# EAGLE board robot_PI4_F28379D_v1 (EAGLE 7.7.0), part 1 of 2
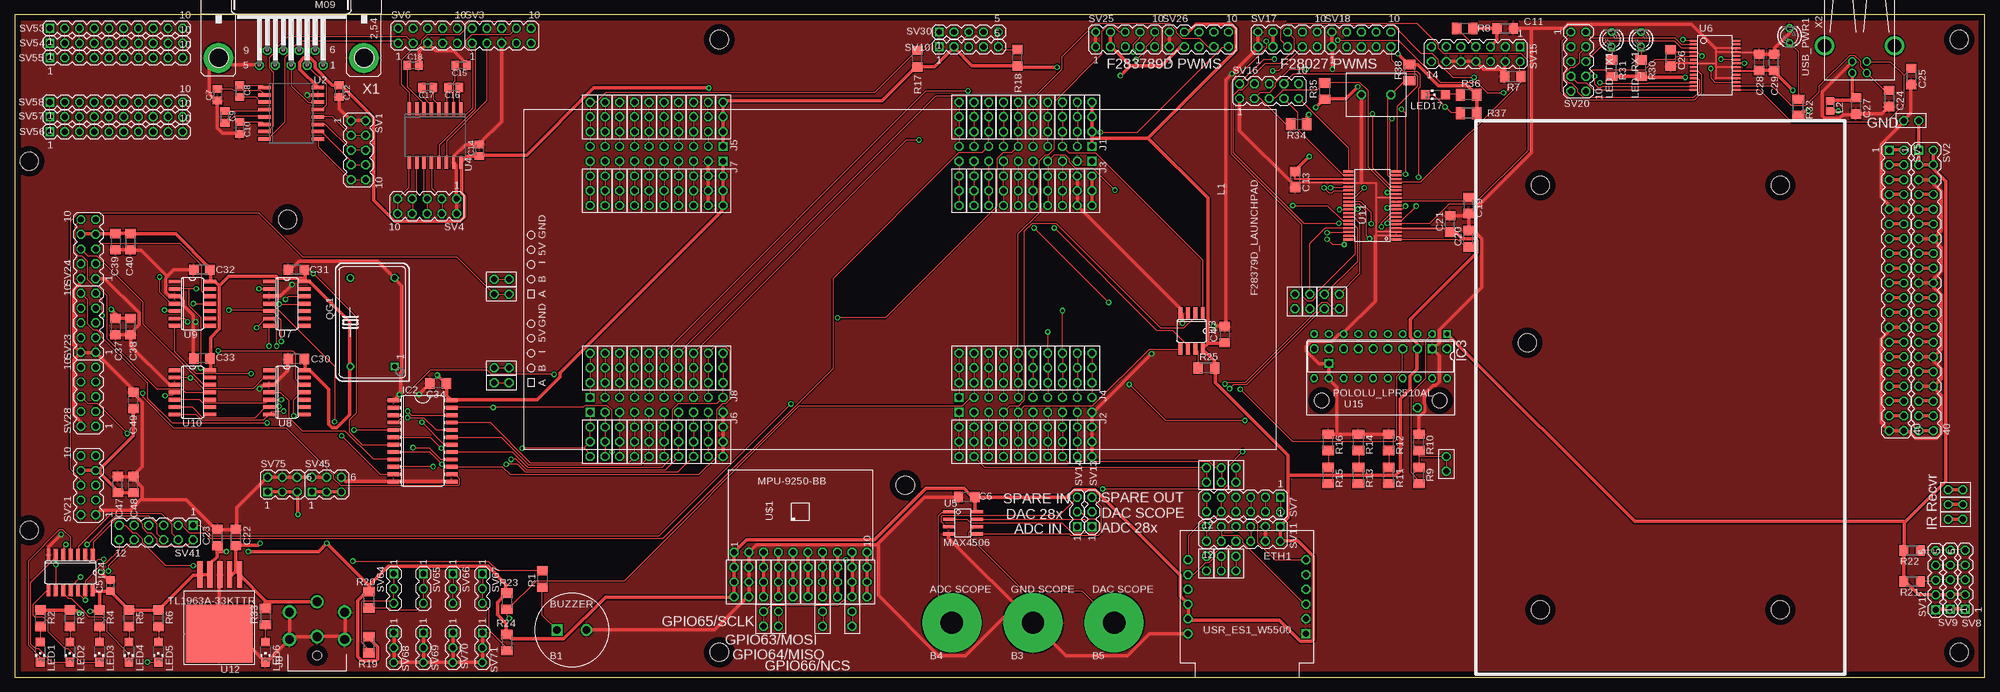
[diagram p6: board, top side]
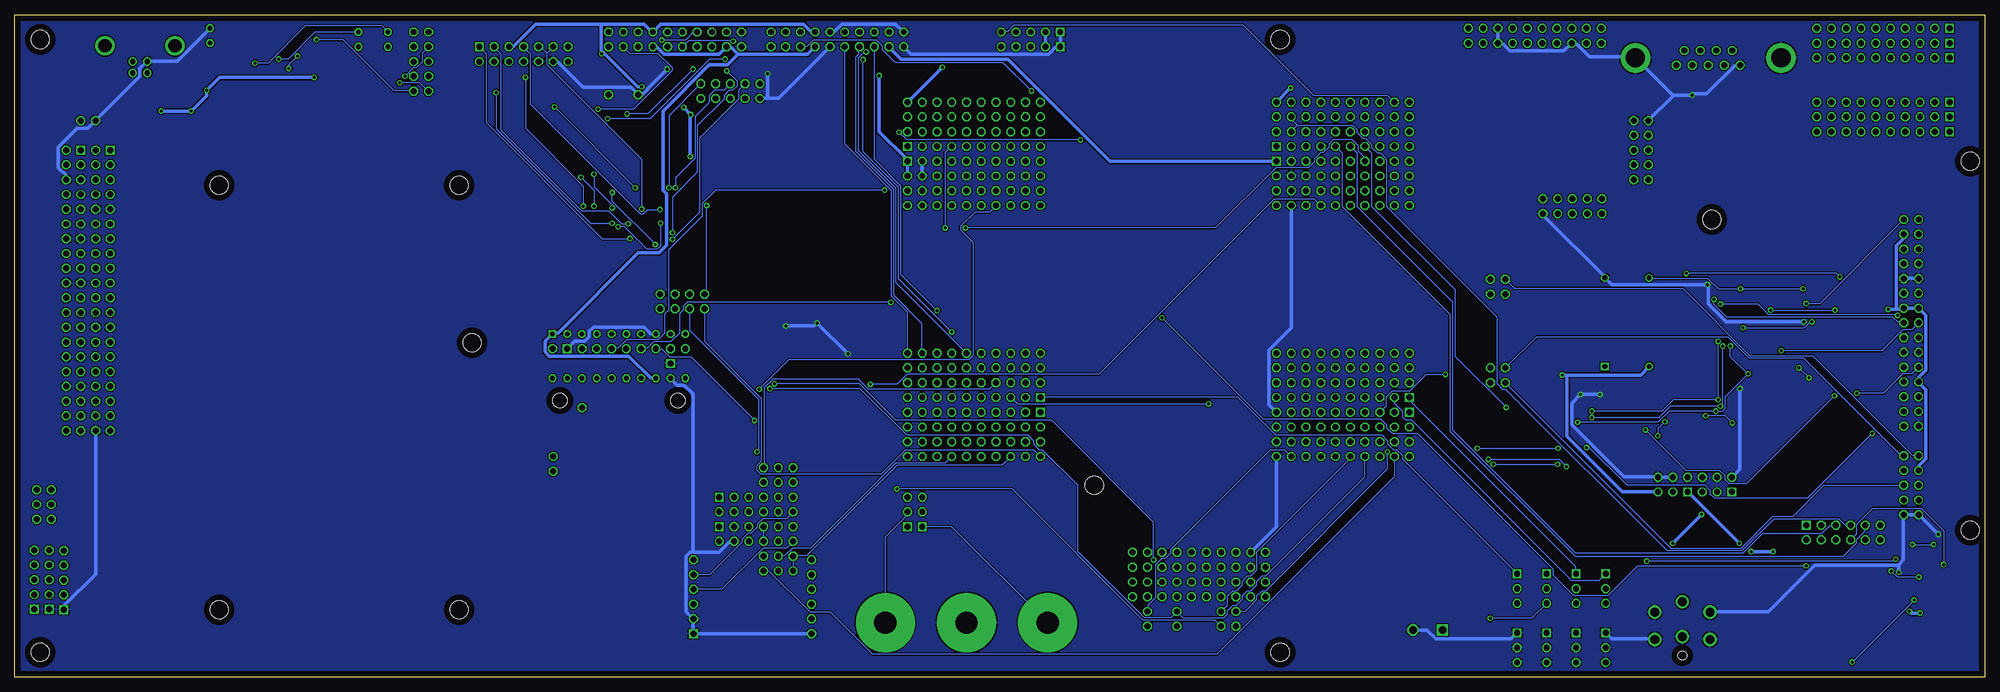
[diagram p7: board, bottom side, seen from below]

Size 339.07 x 113.97 mm. Coordinates in mm from the lower left corner, seen from the top.
Outline: 0,0 339.07,0 339.07,113.97 0,113.97 0,0
Copper layers (1*16): Top 0.035mm / dielectric 1.5mm / Bottom 0.035mm
Design rules "default *": minimum track width 8mil, minimum drill 20mil, track to track 8mil, track to pad 8mil, pad to pad 8mil, via to via 8mil, smd to smd 8mil, copper to edge 40mil, drill to drill 8mil, minimum pad ring 10mil, minimum via ring 8mil, stop-mask expansion 4mil, vias tented up to drill 20mil, thermal gap 10mil
Net classes: 0 default: width 0.203 mm, drill 0.508 mm, clearance 0.203 mm; 1 supply: width 0.61 mm, drill 0.508 mm, clearance 0.203 mm
Holes 3.17 mm at 121.28,4.28 334.64,4.28 334.64,109.69 121.28,109.69 2.53,88.73 2.53,25.23 46.98,78.7 260.34,57.49 153.28,32.98 262.57,84.61 303.84,84.61 303.84,11.58 262.57,11.58

## Footprints (pad centres in the part's own frame; a part is rotated, then mirrored left to right if it is on the bottom)
BUZZER = drill 1.27 square: P$1 -2.54,0 | drill 1.27 octagon: P$2 2.54,0
BANANA_MALE = drill 3.81 pad 10.16: P$1 0,0
C1206 = smd 1.6 x 1.8: 1 -1.4,0; 2 1.4,0
C0805 = smd 1.3 x 1.5: 1 -0.95,0; 2 0.95,0
C0805K = smd 1.3 x 1.6: 1 -1,0; 2 1,0
USR_ES1_W5500 = drill 1.016 square: P$1 0,0 | drill 1.016 octagon: P$2 0,-2.54; P$3 0,-5.08; P$4 0,-7.62; P$5 0,-10.16; P$6 0,-12.7; P$7 20.32,-12.7; P$8 20.32,-10.16; P$9 20.32,-7.62; P$10 20.32,-5.08; P$11 20.32,-2.54; P$12 20.32,0
SO24W = smd 0.66 x 2.032: 1 -6.985,-5.029; 2 -5.715,-5.029; 3 -4.445,-5.029; 4 -3.175,-5.029; 5 -1.905,-5.029; 6 -0.635,-5.029; 7 0.635,-5.029; 8 1.905,-5.029; 9 3.175,-5.029; 10 4.445,-5.029; 11 5.715,-5.029; 12 6.985,-5.029; 13 6.985,5.029; 14 5.715,5.029; 15 4.445,5.029; 16 3.175,5.029; 17 1.905,5.029; 18 0.635,5.029; 19 -0.635,5.029; 20 -1.905,5.029; 21 -3.175,5.029; 22 -4.445,5.029; 23 -5.715,5.029; 24 -6.985,5.029
DIL20 = drill 0.813 square: 1 -11.43,-3.81 | drill 0.813 octagon: 2 -8.89,-3.81; 3 -6.35,-3.81; 4 -3.81,-3.81; 5 -1.27,-3.81; 6 1.27,-3.81; 7 3.81,-3.81; 8 6.35,-3.81; 9 8.89,-3.81; 10 11.43,-3.81; 11 11.43,3.81; 12 8.89,3.81; 13 6.35,3.81; 14 3.81,3.81; 15 1.27,3.81; 16 -1.27,3.81; 17 -3.81,3.81; 18 -6.35,3.81; 19 -8.89,3.81; 20 -11.43,3.81
SO14 = smd 0.66 x 2.032: 1 -3.81,-3.073; 2 -2.54,-3.073; 3 -1.27,-3.073; 4 0,-3.073; 5 1.27,-3.073; 6 2.54,-3.073; 7 3.81,-3.073; 8 3.81,3.073; 9 2.54,3.073; 10 1.27,3.073; 11 0,3.073; 12 -1.27,3.073; 13 -2.54,3.073; 14 -3.81,3.073
STRIP2 = drill 1.016 octagon: P$1 0,0; P$2 2.54,0
CUI_PJ-082BH = drill 1.524: P$1 5.5,0; P$2 -0.508,0; P$3 3.708,4.75; P$4 -0.991,4.75; P$5 -0.991,-4.75; P$6 3.708,-4.75 | hole 1.524: -3.75,0
STRIP3 = drill 1.016 octagon: P$1 0,0; P$2 2.54,0; P$3 5.08,0
F28379D_LAUNCHPAD = drill 1.016 square: P$1 -24.13,33.02; P$11 21.59,10.16; P$21 -21.59,33.02; P$31 19.05,10.16; P$41 -24.13,-30.48; P$51 21.59,-53.34; P$61 -21.59,-30.48; P$71 19.05,-53.34 | drill 1.016 octagon: P$2 -24.13,30.48; P$3 -24.13,27.94; P$4 -24.13,25.4; P$5 -24.13,22.86; P$6 -24.13,20.32; P$7 -24.13,17.78; P$8 -24.13,15.24; P$9 -24.13,12.7; P$10 -24.13,10.16; P$12 21.59,12.7; P$13 21.59,15.24; P$14 21.59,17.78; P$15 21.59,20.32; P$16 21.59,22.86; P$17 21.59,25.4; P$18 21.59,27.94; P$19 21.59,30.48; P$20 21.59,33.02; P$22 -21.59,30.48; P$23 -21.59,27.94; P$24 -21.59,25.4; P$25 -21.59,22.86; P$26 -21.59,20.32; P$27 -21.59,17.78; P$28 -21.59,15.24; P$29 -21.59,12.7; P$30 -21.59,10.16; P$32 19.05,12.7; P$33 19.05,15.24; P$34 19.05,17.78; P$35 19.05,20.32; P$36 19.05,22.86; P$37 19.05,25.4; P$38 19.05,27.94; P$39 19.05,30.48; P$40 19.05,33.02; P$42 -24.13,-33.02; P$43 -24.13,-35.56; P$44 -24.13,-38.1; P$45 -24.13,-40.64; P$46 -24.13,-43.18; P$47 -24.13,-45.72; P$48 -24.13,-48.26; P$49 -24.13,-50.8; P$50 -24.13,-53.34; P$52 21.59,-50.8; P$53 21.59,-48.26; P$54 21.59,-45.72; P$55 21.59,-43.18; P$56 21.59,-40.64; P$57 21.59,-38.1; P$58 21.59,-35.56; P$59 21.59,-33.02; P$60 21.59,-30.48; P$62 -21.59,-33.02; P$63 -21.59,-35.56; P$64 -21.59,-38.1; P$65 -21.59,-40.64; P$66 -21.59,-43.18; P$67 -21.59,-45.72; P$68 -21.59,-48.26; P$69 -21.59,-50.8; P$70 -21.59,-53.34; P$72 19.05,-50.8; P$73 19.05,-48.26; P$74 19.05,-45.72; P$75 19.05,-43.18; P$76 19.05,-40.64; P$77 19.05,-38.1; P$78 19.05,-35.56; P$79 19.05,-33.02; P$80 19.05,-30.48
L0805 = smd 1.3 x 1.5: 1 -0.85,0; 2 0.85,0
CHIPLED_1206 = smd 1.5 x 1.5: A 0,-1.75; C 0,1.75
LED3MM = drill 0.813 octagon: A -1.27,0; K 1.27,0
TH_PUSHBUTTON = drill 1.016 octagon: 1 0,2.54; 2 0,-2.54
DIL14S = drill 0.813 square: 1 -7.62,-3.81 | drill 0.813: 7 7.62,-3.81; 8 7.62,3.81; 14 -7.62,3.81
R1206 = smd 1.6 x 1.803: 1 -1.422,0; 2 1.422,0
M1206 = smd 1.6 x 2: 1 -1.4,0; 2 1.4,0
MA05-2 = drill 1.016 octagon: 1 -5.08,-1.27; 2 -5.08,1.27; 3 -2.54,-1.27; 4 -2.54,1.27; 5 0,-1.27; 6 0,1.27; 7 2.54,-1.27; 8 2.54,1.27; 9 5.08,-1.27; 10 5.08,1.27
MA20-2 = drill 1.016 square: 1 -24.13,-1.27 | drill 1.016 octagon: 2 -24.13,1.27; 3 -21.59,-1.27; 4 -21.59,1.27; 5 -19.05,-1.27; 6 -19.05,1.27; 7 -16.51,-1.27; 8 -16.51,1.27; 9 -13.97,-1.27; 10 -13.97,1.27; 11 -11.43,-1.27; 12 -11.43,1.27; 13 -8.89,-1.27; 14 -8.89,1.27; 15 -6.35,-1.27; 16 -6.35,1.27; 17 -3.81,-1.27; 18 -3.81,1.27; 19 -1.27,-1.27; 20 -1.27,1.27; 21 1.27,-1.27; 22 1.27,1.27; 23 3.81,-1.27; 24 3.81,1.27; 25 6.35,-1.27; 26 6.35,1.27; 27 8.89,-1.27; 28 8.89,1.27; 29 11.43,-1.27; 30 11.43,1.27; 31 13.97,-1.27; 32 13.97,1.27; 33 16.51,-1.27; 34 16.51,1.27; 35 19.05,-1.27; 36 19.05,1.27; 37 21.59,-1.27; 38 21.59,1.27; 39 24.13,-1.27; 40 24.13,1.27
MA06-2 = drill 1.016 square: 1 -6.35,-1.27 | drill 1.016 octagon: 2 -6.35,1.27; 3 -3.81,-1.27; 4 -3.81,1.27; 5 -1.27,-1.27; 6 -1.27,1.27; 7 1.27,-1.27; 8 1.27,1.27; 9 3.81,-1.27; 10 3.81,1.27; 11 6.35,-1.27; 12 6.35,1.27
MA05-1 = drill 1.016 square: 1 -5.08,0 | drill 1.016 octagon: 2 -2.54,0; 3 0,0; 4 2.54,0; 5 5.08,0
MA03-1 = drill 1.016 square: 1 -2.54,0 | drill 1.016 octagon: 2 0,0; 3 2.54,0
MA07-2 = drill 1.016 square: 1 -7.62,-1.27 | drill 1.016 octagon: 2 -7.62,1.27; 3 -5.08,-1.27; 4 -5.08,1.27; 5 -2.54,-1.27; 6 -2.54,1.27; 7 0,-1.27; 8 0,1.27; 9 2.54,-1.27; 10 2.54,1.27; 11 5.08,-1.27; 12 5.08,1.27; 13 7.62,-1.27; 14 7.62,1.27
MA03-2 = drill 1.016 square: 1 -2.54,-1.27 | drill 1.016 octagon: 2 -2.54,1.27; 3 0,-1.27; 4 0,1.27; 5 2.54,-1.27; 6 2.54,1.27
MA10-1 = drill 1.016 square: 1 -11.43,0 | drill 1.016 octagon: 2 -8.89,0; 3 -6.35,0; 4 -3.81,0; 5 -1.27,0; 6 1.27,0; 7 3.81,0; 8 6.35,0; 9 8.89,0; 10 11.43,0
SO16W = smd 0.6 x 2.2: 1 -4.445,-4.6; 2 -3.175,-4.6; 3 -1.905,-4.6; 4 -0.635,-4.6; 5 0.635,-4.6; 6 1.905,-4.6; 7 3.175,-4.6; 8 4.445,-4.6; 9 4.445,4.6; 10 3.175,4.6; 11 1.905,4.6; 12 0.635,4.6; 13 -0.635,4.6; 14 -1.905,4.6; 15 -3.175,4.6; 16 -4.445,4.6
SO08 = smd 0.66 x 2.032: 1 -1.905,-3.073; 2 -0.635,-3.073; 3 0.635,-3.073; 4 1.905,-3.073; 5 1.905,3.073; 6 0.635,3.073; 7 -0.635,3.073; 8 -1.905,3.073
SOIC-8 = smd 1.98 x 0.53: P$1 -2.465,1.905; P$2 -2.465,0.635; P$3 -2.465,-0.635; P$4 -2.465,-1.905; P$5 2.465,-1.905; P$6 2.465,-0.635; P$7 2.465,0.635; P$8 2.465,1.905
SSOP28DB = smd 0.348 x 1.397: 1 -4.225,-3.656; 2 -3.575,-3.656; 3 -2.925,-3.656; 4 -2.275,-3.656; 5 -1.625,-3.656; 6 -0.975,-3.656; 7 -0.325,-3.656; 8 0.325,-3.656; 9 0.975,-3.656; 10 1.625,-3.656; 11 2.275,-3.656; 12 2.925,-3.656; 13 3.575,-3.656; 14 4.225,-3.656; 15 4.225,3.656; 16 3.575,3.656; 17 2.925,3.656; 18 2.275,3.656; 19 1.625,3.656; 20 0.975,3.656; 21 0.325,3.656; 22 -0.325,3.656; 23 -0.975,3.656; 24 -1.625,3.656; 25 -2.275,3.656; 26 -2.925,3.656; 27 -3.575,3.656; 28 -4.225,3.656
DA38 = smd 0.35 x 1.705: 1 -5.85,-4.12; 2 -5.2,-4.12; 3 -4.55,-4.12; 4 -3.9,-4.12; 5 -3.25,-4.12; 6 -2.6,-4.12; 7 -1.95,-4.12; 8 -1.3,-4.12; 9 -0.65,-4.12; 10 0,-4.12; 11 0.65,-4.12; 12 1.3,-4.12; 13 1.95,-4.12; 14 2.6,-4.12; 15 3.25,-4.12; 16 3.9,-4.12; 17 4.55,-4.12; 18 5.2,-4.12; 19 5.85,-4.12; 20 5.85,4.12; 21 5.2,4.12; 22 4.55,4.12; 23 3.9,4.12; 24 3.25,4.12; 25 2.6,4.12; 26 1.95,4.12; 27 1.3,4.12; 28 0.65,4.12; 29 0,4.12; 30 -0.65,4.12; 31 -1.3,4.12; 32 -1.95,4.12; 33 -2.6,4.12; 34 -3.25,4.12; 35 -3.9,4.12; 36 -4.55,4.12; 37 -5.2,4.12; 38 -5.85,4.12
TL1963AKTTR = smd 0.914 x 4.572: P$1 -3.81,-10.16; P$2 -2.108,-10.16; P$3 -0.406,-10.16; P$4 1.295,-10.16; P$5 2.997,-10.16 | smd 11.5 x 10: P$6 -0.3,0
POLOLU_LPR510AL = drill 1.016 octagon: P$1 0,0; P$3 0,-5.08; P$4 0,-7.62; P$5 0,-10.16; P$6 0,-12.7; P$7 0,-15.24; P$8 0,-17.78; P$9 0,-20.32; P$10 0,-22.86; P$12 10.16,-5.08 | drill 1.016 square: P$2 0,-2.54; P$11 2.54,-20.32 | hole 2.54: 8.89,-1.27; 8.89,-21.59
MPU-9250-BB = drill 1.016 octagon: 1 -11.434,-6.96; 2 -8.894,-6.96; 3 -6.354,-6.96; 4 -3.814,-6.96; 5 -1.274,-6.96; 6 1.266,-6.96; 7 3.806,-6.96; 8 6.346,-6.96; 9 8.886,-6.96; 10 11.426,-6.96
M09HP = drill 1.016 octagon: 1 -5.486,1.27; 2 -2.743,1.27; 3 0,1.27; 4 2.743,1.27; 5 5.486,1.27; 6 -4.115,-1.27; 7 -1.372,-1.27; 8 1.372,-1.27; 9 4.115,-1.27 | drill 3.302 pad 5.08: G1 -12.522,0; G2 12.522,0
USB-B-H = drill 0.914: D+ 0,1.25; D- 1.981,1.25; GND 0,-1.25; VBUS 1.981,-1.25 | drill 2.286: P$1 -2.718,-6.02; P$2 -2.718,6.02

## Placement (x,y rotation side)
B1  BUZZER  [BUZZER]  95.88,8.09 0 top
B3  GND SCOPE  [BANANA_MALE]  175.25,9.36 0 top
B4  ADC SCOPE  [BANANA_MALE]  161.28,9.36 0 top
B5  DAC SCOPE  [BANANA_MALE]  189.22,9.36 0 top
C4  0.1uf  [C1206]  208.27,58.89 90 top
C5  0.1uF  [C0805]  16.5,15.71 90 top
C6  0.1uf  [C1206]  163.82,30.95 180 top
C7  0.1uF  [C0805K]  34.92,100.16 90 top
C8  0.1uF  [C0805K]  38.73,100.8 270 top
C9  0.1uF  [C0805K]  36.19,96.35 270 top
C10  0.1uF  [C0805K]  38.73,94.45 270 top
C11  0.1 uF  [C1206]  256.53,111.59 0 top
C12  0.1uF  [C0805K]  55.87,100.8 270 top
C13  2.2 uF  [C1206]  220.34,85.56 270 top
C14  0.1uF  [C0805K]  80,90.64 90 top
C15  0.1uF  [C0805K]  76.83,105.24 180 top
C16  0.1uF  [C0805K]  75.56,101.43 180 top
C17  0.1uF  [C0805K]  71.11,101.43 180 top
C18  0.1uF  [C0805K]  68.57,105.24 0 top
C19  2.2 uF  [C1206]  250.19,81.11 270 top
C20  2.2 uF  [C1206]  250.19,75.4 90 top
C21  2.2 uF  [C1206]  247.01,77.94 90 top
C22  10 uF  [C1206]  38.09,23.96 90 top
C23  10 uF  [C1206]  34.92,23.96 90 top
C24  47pF  [C1206]  322.57,99.53 270 top
C25  47pF  [C1206]  326.38,103.34 270 top
C26  0.1uF  [C1206]  284.98,106.52 270 top
C27  10nF  [C1206]  316.86,98.26 270 top
C28  0.1uF  [C1206]  300.22,105.75 90 top
C29  4.7uF  [C1206]  302.76,105.75 90 top
C30  0.1uF  [C1206]  48.51,54.7 180 top
C31  0.1uF  [C1206]  48.51,70.07 180 top
C32  0.1uF  [C1206]  32.25,70.07 180 top
C33  0.1uF  [C1206]  32.25,54.83 180 top
C34  0.1uF  [C1206]  72.89,50.51 180 top
C37  0.1uF  [C1206]  17.39,60.29 270 top
C38  0.1uF  [C1206]  19.93,60.29 270 top
C39  0.1uF  [C1206]  17.39,74.89 270 top
C40  0.1uF  [C1206]  19.93,74.89 270 top
C47  0.1uF  [C1206]  17.77,33.11 90 top
C48  0.1uF  [C1206]  20.44,33.11 90 top
C49  0.1uF  [C1206]  20.44,47.59 90 top
ETH1  USR_ES1_W5500  [USR_ES1_W5500]  222.25,7.46 180 top
IC2  743384DW  [SO24W]  70.23,40.6 270 top
IC3  ADXRS300EB  [DIL20]  235.07,55.21 180 top
IC4  74ALS04D  [SO14]  9.65,18 180 top
J1  STRIP2  [STRIP2]  246.38,37.94 270 top
J2  STRIP2  [STRIP2]  82.54,65.88 0 top
J3  STRIP2  [STRIP2]  82.54,50.63 0 top
J5  STRIP2  [STRIP2]  82.54,68.41 0 top
J6  STRIP2  [STRIP2]  82.54,53.18 0 top
J7  STRIP2  [STRIP2]  325.12,95.72 0 top
J8  PJ-082BH  [CUI_PJ-082BH]  52.06,7.46 90 top
J9  STRIP2  [STRIP2]  210.18,36.03 270 top
J10  STRIP3  [STRIP3]  185.41,93.81 90 top
J11  STRIP2  [STRIP2]  210.18,20.79 270 top
J12  STRIP2  [STRIP2]  332.74,27.14 0 top
J13  STRIP2  [STRIP2]  332.74,29.68 0 top
J14  STRIP3  [STRIP3]  182.88,93.81 90 top
J15  STRIP3  [STRIP3]  180.33,93.81 90 top
J16  STRIP3  [STRIP3]  177.79,93.81 90 top
J17  STRIP3  [STRIP3]  175.25,93.81 90 top
J18  STRIP3  [STRIP3]  172.72,98.89 270 top
J19  STRIP3  [STRIP3]  170.18,98.89 270 top
J20  STRIP3  [STRIP3]  167.63,93.81 90 top
J21  STRIP3  [STRIP3]  165.09,98.89 270 top
J22  STRIP2  [STRIP2]  332.74,32.22 0 top
J28  STRIP3  [STRIP3]  162.56,93.81 90 top
J29  STRIP3  [STRIP3]  162.56,37.94 90 top
J30  STRIP3  [STRIP3]  165.09,37.94 90 top
J31  STRIP3  [STRIP3]  167.63,37.94 90 top
J32  STRIP3  [STRIP3]  170.18,37.94 90 top
J33  STRIP3  [STRIP3]  172.72,37.94 90 top
J35  STRIP2  [STRIP2]  225.42,65.88 270 top
J36  STRIP2  [STRIP2]  222.88,65.88 270 top
J37  STRIP2  [STRIP2]  220.34,65.88 270 top
J38  STRIP2  [STRIP2]  227.96,65.88 270 top
J66  STRIP2  [STRIP2]  207.64,20.79 270 top
J67  STRIP2  [STRIP2]  207.64,36.03 270 top
J68  STRIP2  [STRIP2]  205.1,20.79 270 top
J69  STRIP2  [STRIP2]  205.1,36.03 270 top
J98  STRIP3  [STRIP3]  175.25,37.94 90 top
J99  STRIP3  [STRIP3]  177.79,37.94 90 top
J100  STRIP3  [STRIP3]  180.33,37.94 90 top
J101  STRIP3  [STRIP3]  182.88,37.94 90 top
J102  STRIP3  [STRIP3]  185.41,37.94 90 top
J103  STRIP3  [STRIP3]  185.41,81.11 90 top
J104  STRIP3  [STRIP3]  182.88,81.11 90 top
J105  STRIP3  [STRIP3]  180.33,81.11 90 top
J106  STRIP3  [STRIP3]  177.79,81.11 90 top
J107  STRIP3  [STRIP3]  175.25,81.11 90 top
J108  STRIP3  [STRIP3]  172.72,81.11 90 top
J109  STRIP3  [STRIP3]  170.18,81.11 90 top
J110  STRIP3  [STRIP3]  167.63,81.11 90 top
J111  STRIP3  [STRIP3]  165.09,81.11 90 top
J112  STRIP3  [STRIP3]  162.56,81.11 90 top
J113  STRIP3  [STRIP3]  162.56,50.63 90 top
J114  STRIP3  [STRIP3]  165.09,50.63 90 top
J115  STRIP3  [STRIP3]  167.63,50.63 90 top
J116  STRIP3  [STRIP3]  170.18,50.63 90 top
J117  STRIP3  [STRIP3]  172.72,50.63 90 top
J118  STRIP3  [STRIP3]  175.25,50.63 90 top
J119  STRIP3  [STRIP3]  177.79,50.63 90 top
J120  STRIP3  [STRIP3]  180.33,50.63 90 top
J121  STRIP3  [STRIP3]  182.88,50.63 90 top
J122  STRIP3  [STRIP3]  185.41,50.63 90 top
J123  STRIP3  [STRIP3]  123.82,18.89 270 top
J124  STRIP3  [STRIP3]  126.36,18.89 270 top
J125  STRIP3  [STRIP3]  128.9,18.89 270 top
J126  STRIP3  [STRIP3]  131.44,18.89 270 top
J127  STRIP3  [STRIP3]  133.98,18.89 270 top
J128  STRIP3  [STRIP3]  136.52,18.89 270 top
J129  STRIP3  [STRIP3]  139.06,18.89 270 top
J130  STRIP3  [STRIP3]  141.6,18.89 270 top
J131  STRIP3  [STRIP3]  144.14,18.89 270 top
J132  STRIP3  [STRIP3]  146.68,18.89 270 top
J133  STRIP3  [STRIP3]  121.91,50.63 90 top
J134  STRIP3  [STRIP3]  119.38,50.63 90 top
J135  STRIP3  [STRIP3]  116.83,50.63 90 top
J136  STRIP3  [STRIP3]  114.29,50.63 90 top
J137  STRIP3  [STRIP3]  111.75,50.63 90 top
J138  STRIP3  [STRIP3]  109.21,50.63 90 top
J139  STRIP3  [STRIP3]  106.67,50.63 90 top
J140  STRIP3  [STRIP3]  104.13,50.63 90 top
J141  STRIP3  [STRIP3]  101.59,50.63 90 top
J142  STRIP3  [STRIP3]  99.05,50.63 90 top
J143  STRIP3  [STRIP3]  99.05,86.19 270 top
J144  STRIP3  [STRIP3]  101.59,86.19 270 top
J145  STRIP3  [STRIP3]  104.13,86.19 270 top
J146  STRIP3  [STRIP3]  106.67,86.19 270 top
J147  STRIP3  [STRIP3]  109.21,86.19 270 top
J148  STRIP3  [STRIP3]  111.75,86.19 270 top
J149  STRIP3  [STRIP3]  114.29,86.19 270 top
J150  STRIP3  [STRIP3]  116.83,86.19 270 top
J151  STRIP3  [STRIP3]  119.38,86.19 270 top
J152  STRIP3  [STRIP3]  121.91,86.19 270 top
J153  STRIP3  [STRIP3]  121.91,43.02 270 top
J154  STRIP3  [STRIP3]  119.38,43.02 270 top
J155  STRIP3  [STRIP3]  116.83,43.02 270 top
J156  STRIP3  [STRIP3]  114.29,43.02 270 top
J157  STRIP3  [STRIP3]  111.75,43.02 270 top
J158  STRIP3  [STRIP3]  109.21,43.02 270 top
J159  STRIP3  [STRIP3]  106.67,43.02 270 top
J160  STRIP3  [STRIP3]  104.13,43.02 270 top
J161  STRIP3  [STRIP3]  101.59,43.02 270 top
J162  STRIP3  [STRIP3]  99.05,43.02 270 top
J163  STRIP3  [STRIP3]  99.05,93.81 90 top
J164  STRIP3  [STRIP3]  101.59,93.81 90 top
J165  STRIP3  [STRIP3]  104.13,93.81 90 top
J166  STRIP3  [STRIP3]  106.67,93.81 90 top
J167  STRIP3  [STRIP3]  109.21,93.81 90 top
J168  STRIP3  [STRIP3]  111.75,93.81 90 top
J169  STRIP3  [STRIP3]  114.29,93.81 90 top
J170  STRIP3  [STRIP3]  116.83,93.81 90 top
J176  STRIP3  [STRIP3]  119.38,93.81 90 top
J177  STRIP3  [STRIP3]  121.91,93.81 90 top
J204  STRIP2  [STRIP2]  131.44,11.27 270 top
J205  STRIP2  [STRIP2]  139.06,11.27 270 top
J206  STRIP2  [STRIP2]  128.9,11.27 270 top
J207  STRIP2  [STRIP2]  144.14,11.27 270 top
L1  F28379D_LAUNCHPAD  [F28379D_LAUNCHPAD]  152.39,67.14 270 top
L2  BLM21PG221SN1D  [L0805]  312.42,98.26 270 top
LED1  [CHIPLED_1206]  4.44,4.28 180 top
LED2  [CHIPLED_1206]  9.52,4.28 180 top
LED3  [CHIPLED_1206]  14.6,4.28 180 top
LED4  [CHIPLED_1206]  19.68,4.28 180 top
LED5  [CHIPLED_1206]  24.76,4.28 180 top
LED6  [CHIPLED_1206]  43.17,4.28 180 top
LED17  [CHIPLED_1206]  244.47,100.16 90 top
LED_RX1  [LED3MM]  279.9,109.69 90 top
LED_TX1  [LED3MM]  274.82,109.69 90 top
P1  [TH_PUSHBUTTON]  234.31,100.16 270 top
QG1  [DIL14S]  61.59,61.05 90 top
R1  100  [R1206]  90.8,16.85 90 top
R2  1K  [R1206]  4.44,10.12 270 top
R3  1K  [R1206]  9.52,10.12 270 top
R4  1K  [R1206]  14.6,10.12 270 top
R5  1K  [R1206]  19.68,10.12 270 top
R6  1K  [R1206]  24.76,10.12 270 top
R7  4.7K  [M1206]  257.81,103.34 180 top
R8  4.7K  [M1206]  249.55,111.59 180 top
R9  1.7x  [M1206]  241.68,34.63 270 top
R10  3.3x  [M1206]  241.68,40.35 270 top
R11  1.7x  [M1206]  236.47,34.63 270 top
R12  3.3x  [M1206]  236.47,40.35 270 top
R13  1.7x  [M1206]  231.26,34.63 270 top
R14  3.3x  [M1206]  231.26,40.35 270 top
R15  1.7x  [M1206]  226.06,34.63 270 top
R16  3.3x  [M1206]  226.06,40.35 270 top
R17  [R1206]  155.32,106.39 270 top
R18  [R1206]  172.59,106.52 270 top
R19  10K  [M1206]  60.95,5.55 90 top
R20  10K  [M1206]  60.95,13.3 90 top
R21  [R1206]  326.51,16.47 180 top
R22  [R1206]  326.51,21.81 180 top
R23  10k  [M1206]  84.7,13.04 90 top
R24  10K  [M1206]  84.7,5.93 90 top
R25  10K  [M1206]  205.1,53.18 0 top
R30  470  [M1206]  279.9,104.74 270 top
R31  470  [M1206]  274.82,104.74 270 top
R32  470  [M1206]  306.95,98.01 270 top
R33  470  [M1206]  43.17,10.38 90 top
R34  4.7k  [M1206]  220.97,95.08 180 top
R35  4.7k  [M1206]  225.42,100.8 90 top
R36  1K  [M1206]  250.19,100.16 0 top
R37  4.7k  [M1206]  250.19,96.99 0 top
R38  4.7k  [M1206]  240.02,103.97 90 top
SV1  [MA05-2]  59.18,90.64 270 top
SV2  [MA20-2]  328.93,66.51 270 top
SV3  [MA05-2]  83.81,110.32 0 top
SV4  [MA05-2]  70.99,80.99 180 top
SV5  [MA20-2]  323.84,66.51 270 top
SV6  [MA05-2]  71.11,110.32 0 top
SV7  [MA06-2]  211.45,29.68 180 top
SV8  [MA05-1]  335.66,16.73 90 top
SV9  [MA05-1]  333.12,16.73 90 top
SV10  [MA05-1]  164.21,108.42 0 top
SV11  [MA06-2]  211.45,24.6 180 top
SV12  [MA05-1]  330.59,16.66 90 top
SV13  [MA03-1]  185.41,28.41 90 top
SV14  [MA03-1]  182.88,28.41 90 top
SV15  [MA07-2]  251.45,107.15 180 top
SV16  [MA05-2]  215.89,100.8 0 top
SV17  [MA05-2]  219.07,109.69 0 top
SV18  [MA05-2]  231.77,109.69 0 top
SV20  [MA05-2]  269.11,105.88 270 top
SV21  [MA05-2]  12.69,32.98 90 top
SV23  [MA05-2]  12.69,60.92 90 top
SV24  [MA05-2]  12.69,73.62 90 top
SV25  [MA05-2]  191.13,109.69 0 top
SV26  [MA05-2]  203.83,109.69 0 top
SV28  [MA05-2]  12.69,48.22 90 top
SV30  [MA05-1]  164.21,110.96 0 top
SV41  [MA06-2]  24.38,24.85 180 top
SV45  [MA03-2]  53.72,33.11 0 top
SV53  [MA10-1]  17.52,111.59 0 top
SV54  [MA10-1]  17.52,109.05 0 top
SV55  [MA10-1]  17.52,106.52 0 top
SV56  [MA10-1]  17.52,93.81 0 top
SV57  [MA10-1]  17.52,96.35 0 top
SV58  [MA10-1]  17.52,98.89 0 top
SV64  [MA03-1]  65.27,15.2 270 top
SV65  [MA03-1]  70.35,15.2 270 top
SV66  [MA03-1]  75.43,15.2 270 top
SV67  [MA03-1]  80.51,15.2 270 top
SV68  [MA03-1]  65.27,5.04 270 top
SV69  [MA03-1]  70.35,5.04 270 top
SV70  [MA03-1]  75.43,5.04 270 top
SV71  [MA03-1]  80.51,5.04 270 top
SV75  [MA03-2]  46.1,33.11 0 top
U2  MAX3232IDWR  [SO16W]  47.62,96.99 270 top
U3  IS62WVS512  [SO08]  202.56,59.52 180 top
U4  MAX3232IDWR  [SO16W]  72.38,93.18 180 top
U5  MAX4506  [SOIC-8]  163.19,26.51 0 top
U6  FT232RL  [SSOP28DB]  292.6,105.24 270 top
U7  [SO14]  46.86,64.22 270 top
U8  [SO14]  46.86,48.98 270 top
U9  [SO14]  30.6,64.22 270 top
U10  [SO14]  30.6,48.98 270 top
U11  F28027  [DA38]  233.68,81.11 90 top
U12  TL1963A-33KTTR  [TL1963AKTTR]  34.92,7.46 180 top
U15  POLOLU_LPR510AL  [POLOLU_LPR510AL]  246.5,56.48 270 top
U$1  MPU-9250-BB  [MPU-9250-BB]  135.25,28.41 0 top
USB_PWR1  [LED3MM]  305.43,110.32 90 top
X1  [M09HP]  47.62,106.52 180 top
X2  [USB-B-H]  317.5,105.88 270 top

## Tracks (layer width: path | path; a pad name or v marks a point on that pad's centre or on a via)
28027_GPIO0  (via drill 0.51)
  Top 0.203: v215.39,109.36 215.39,108.24 209.29,102.15 209.29,90.06 221.48,77.86 221.48,65.67 222.4,64.76 223.31,64.76 224.02,65.47 224.02,66.08 230.73,72.78 230.73,75.63 230.52,75.83 229.61,75.83 U11.37
  Bottom 0.203: v215.39,109.36 215.89,109.36 216.1,109.56 223.01,109.56 SV17.9
28027_GPIO1  (via drill 0.51)
  Top 0.203: v225.85,76.44 225.95,76.54 229.51,76.54 U11.36 | v216.5,104.28 217.52,104.28 221.58,108.34 SV17.7
  Bottom 0.203: v225.85,76.44 225.85,82.54 221.58,86.8 221.58,94.83 217.01,99.4 217.01,100.01 216.1,100.93 215.49,100.93 214.78,101.64 214.78,102.55 v216.5,104.28
28027_GPIO2
  Top 0.203: SV17.5 217.93,109.56 217.93,111.39 219.04,112.51 241.29,112.51 244.95,108.85 244.95,108.24 245.87,107.33 259.18,107.33 260.4,106.11 260.4,90.56 251.15,81.32 246.78,81.32 243.43,77.96 237.84,77.96 U11.5
28027_GPIO3  (via drill 0.51)
  Top 0.203: v241.19,81.01 238.75,78.57 237.84,78.57 U11.6 | v251.15,103.16 247.49,103.16 244.95,105.7 244.95,106.31 243.94,107.33 242.01,107.33 237.23,112.1 225.34,112.1 224.23,110.98 SV17.10
  Bottom 0.203: v241.19,81.01 241.19,84.47 251.15,94.42 v251.15,103.16
28027_GPIO4  (via drill 0.51)
  Top 0.203: v236.21,78.07 236.21,78.47 236.82,79.08 237.74,79.08 U11.7 | v256.23,100.52 253.49,100.52 251.66,102.35 245.36,102.35 238.14,109.56 v227.68,109.56
  Bottom 0.203: v236.21,78.07 239.97,78.07 256.23,94.32 v256.23,100.52 | v227.68,109.56 223.62,109.56 222.3,110.88 221.69,110.88 SV17.8
28027_GPIO5  (via drill 0.51)
  Top 0.203: v235.2,77.46 235.2,78.17 236.82,79.79 237.74,79.79 U11.8 | v227.88,78.07 221.89,78.07 209.7,90.26 209.7,100.01 210.61,100.93 211.22,100.93 212.24,101.94 212.24,102.55 215.18,105.5 217.72,105.5 220.16,107.94 220.16,109.87 SV17.6
  Bottom 0.203: v235.2,77.46 234.08,77.46 230.22,73.6 228.49,73.6 227.88,74.21 v227.88,78.07
28027_GPIO6  (via drill 0.51)
  Top 0.203: v239.37,81.01 238.86,80.5 237.84,80.5 U11.9 | v241.6,85.99 241.6,101.23 241.8,101.43 241.8,103.67 241.29,104.18 238.96,104.18 236.93,106.21 236.93,108.34 SV18.9
  Bottom 0.203: v239.37,81.01 239.37,83.76 v241.6,85.99
28027_GPIO7  (via drill 0.51)
  Top 0.203: U11.10 236.62,81.11 v236.21,80.71 | v239.37,86.5 239.37,96.96 v238.65,97.68
  Bottom 0.203: v236.21,80.71 236.21,81.22 239.37,84.37 v239.37,86.5 | v238.65,97.68 232.56,97.68 225.95,104.28 225.95,104.89 228.39,107.33 233.27,107.33 234.28,108.34 SV18.7
28027_GPIO12  (via drill 0.51)
  Top 0.203: v236.21,83.35 236.42,83.15 237.74,83.15 U11.13 | v228.8,74.41 226.77,74.41 v225.85,75.32
  Bottom 0.203: v236.21,83.35 236.21,81.83 v228.8,74.41 | v225.85,75.32 221.18,80 221.18,92.7 214.47,99.4 214.47,100.93 213.35,102.04 SV16.4
28027_GPIO34  (via drill 0.51)
  Top 0.203: 246.22,98.13 247.29,97.07 248.71,97.07 R37.1 | 246.22,98.13 244.24,100.11 242.82,100.11 LED17.C | v232.25,84.16 230.52,82.44 229.61,82.44 U11.27 | v246.17,98.08 246.22,98.13
  Bottom 0.203: v246.17,98.08 v232.25,84.16
28027_SCL  (via drill 0.51)
  Top 0.203: v233.68,96.86 233.68,87.62 236.93,84.37 237.74,84.37 U11.15 | v222.3,104.58 219.35,104.58 217.01,102.25 217.01,101.64 216,100.62 214.37,100.62 213.35,99.61 SV16.3 213.86,100.01 218.74,95.14 219.55,95.14 R34.2
  Bottom 0.203: v233.68,96.86 230.02,96.86 v222.3,104.58
28027_SDA
  Top 0.203: U11.14 237.74,83.76 236.93,83.76 232.86,87.82 232.86,100.93 231.44,102.35 225.55,102.35 225.44,102.25 R35.2 225.34,102.15 224.12,100.93 218.23,100.93 216.91,99.61 215.89,99.61 SV16.5
28027_SPICLKA
  Top 0.203: U11.32 229.61,79.08 230.52,79.08 231.54,78.07 231.54,69.43 227.99,65.88 J38.P$1
28027_SPISIMOA
  Top 0.203: U11.35 229.51,77.25 225.55,77.25 222.9,74.61 222.9,65.88 J36.P$1
28027_SPISOMIA
  Top 0.203: U11.34 229.61,77.86 230.42,77.86 231.13,77.15 231.13,71.56 225.44,65.88 J35.P$1
28027_SPISTEA  (via drill 0.51)
  Top 0.203: v219.96,81.11 225.95,81.11 228.49,78.57 229.51,78.57 U11.33
  Bottom 0.203: v219.96,81.11 219.96,66.18 220.26,65.88 J37.P$1
+3.3V  (via drill 0.51)
  Top 0.356: U11.22 220.34,85.66 C13.1 | U11.4 247.01,77.21 C21.1
  Top 0.61: C6.1 165.3,30.93 165.3,28.79 165.6,28.49 U5.P$8 | C6.1 164.99,31.13 164.69,31.13 163.37,32.45 156.87,32.45 148.03,23.61 125.98,23.61 123.84,21.48 U$1.1 123.84,21.17 123.84,18.94 J123.P$1 123.84,18.63 123.84,16.6 J123.P$2 123.84,16.29 123.84,13.86 J123.P$3 123.54,13.75 101.7,13.75 94.48,6.54 85.54,6.54 84.93,7.15 R24.2 84.63,7.35 84.63,9.18 83.1,10.71 83.1,12.84 84.63,14.36 R23.2 84.53,14.67 84.53,15.99 81.48,19.04 64.31,19.04 61.06,15.79 | 34.84,21.58 34.84,20.66 33.62,19.44 U12.P$4 U12.P$5 31.69,17.51 30.78,17.51 24.99,11.72 R6.1 24.68,11.52 19.91,11.52 R5.1 19.6,11.62 16.66,14.57 C5.1 16.45,14.77 14.62,14.77 | 34.84,21.58 34.84,22.49 C23.1 | R2.1 4.46,11.52 9.44,11.52 R3.1 9.75,11.42 10.77,11.42 v11.17,11.01 | 14.62,14.77 13.61,14.77 IC4.14 | 14.62,14.77 14.62,11.62 R4.1 14.42,11.32 v13,11.32 | SV75.1 SV75.3 SV75.5 48.76,31.64 v48.76,27.98 | R19.2 60.95,6.74 62.48,5.22 62.48,3.09 62.17,2.78 59.74,2.78 59.02,3.49 59.02,13.15 60.55,14.67 60.95,14.67 R20.2 61.06,14.97 61.06,15.79 | 61.06,15.79 60.85,15.89 v53.74,23 52.32,21.58 v40.23,21.58 | v36.47,21.58 34.84,21.58 | C21.1 247.09,76.44 248.1,76.44 249.12,75.42 251.25,75.42 251.66,75.02 251.66,72.99 240.18,61.51 240.18,58.56 241.4,57.34 241.4,56.53 U15.P$3 241.29,56.22 241.29,52.97 240.08,51.75 240.08,49.52 238.45,47.89 238.45,35.4 237.74,34.68 219.15,34.68 | 205.43,57.44 208.27,57.44 C4.1 | 205.43,57.44 204.52,56.53 U3.8 204.62,56.22 206.45,54.39 206.45,53.18 R25.2 206.65,52.97 206.65,50.63 219.15,38.14 219.15,34.68 | 219.15,34.68 219.15,27.37 217.93,26.15 SV11.1 217.82,25.85 217.82,23.41 SV11.2 218.13,23.41 220.87,23.41 223.51,20.77 223.51,6.44 223.21,6.13 221.28,6.13 217.62,9.79 202.18,9.79 ETH1.P$11 201.98,10 201.98,12.54 ETH1.P$10 201.77,12.74 200.65,13.86 200.65,17.51 185.92,32.24 182.37,32.24 181.05,30.93 165.6,30.93 C6.1
  Top 0.61: R37.2 251.66,97.07 251.66,99.91 R36.2 251.56,100.22 250.03,101.74 245.05,101.74 241.5,105.3 240.08,105.3 R38.2 239.77,105.5 v238.04,107.23 | v222.7,96.76 222.4,96.46 222.4,95.14 R34.1 | v223.92,97.98 225.34,99.4 R35.1 225.65,99.5 229.1,99.5 v231.13,101.54 | v222.8,89.55 220.37,87.11 C13.1 | SV15.5 254,108.44 255.11,109.56 255.11,111.59 C11.1 R8.1 | U2.16 49.07,104.58 49.07,105.8 49.78,106.52 50.9,106.52 51.71,105.7 51.71,104.79 54.66,101.84 55.87,101.84 C12.1 56.08,101.64 56.38,101.64 61.77,96.25 61.77,82.03 65.42,78.37 76.6,78.37 77.41,79.18 77.41,82.74 76.91,83.25 76.91,88.33 U4.16 76.91,88.63 77.82,89.55 79.95,89.55 C14.1 80.26,89.75 88.08,89.75 99.66,101.33 v119.48,101.33 | 185.41,92.7 J10.P$1 J10.P$2 J10.P$3 | 185.41,92.7 L1.P$1 | L1.P$41 J177.P$1 J177.P$2 J177.P$3 122.12,99.1 149.25,99.1 155.04,104.89 R17.2 155.34,104.99 158.29,104.99 161.64,108.34 SV10.2 161.84,108.14 164.79,105.19 172.51,105.19 R18.2 172.82,104.89 v179.42,104.89 | 195.07,92.7 210.2,107.84 210.2,111.49 209.39,112.31 203.3,112.31 201.98,110.98 201.37,110.98 SV26.4 | 185.41,92.7 195.07,92.7 | 195.07,92.7 205.33,82.44 205.33,57.65 205.43,57.44
  Bottom 0.61: v11.17,11.01 12.69,11.01 v13,11.32 | v53.74,23 v48.76,27.98 | v40.23,21.58 v36.47,21.58 | v223.92,97.98 v222.7,96.76 222.8,96.56 v222.8,89.55 | SV26.4 201.37,110.98 201.98,110.98 203.3,112.31 227.88,112.31 SV18.4 229.51,111.09 230.73,112.31 238.14,112.31 | 238.14,112.31 249.42,112.31 253.28,108.44 254,108.44 SV15.5 | v231.13,101.54 231.85,101.54 237.74,107.43 | 237.74,107.43 238.14,107.84 238.14,112.31 | v238.04,107.23 237.94,107.23 237.74,107.43 | SV30.2 161.64,110.88 161.64,108.44 SV10.2 | v179.42,104.89 J10.P$3 | J177.P$3 v119.48,101.33
+5V  (via drill 0.51)
  Top 0.61: 49.98,68.62 49.98,68.11 U7.14 50.29,68.11 50.69,68.11 57.7,61.1 57.7,53.68 QG1.14 57.7,53.38 57.7,45.15 55.47,42.91 54.66,42.91 54.05,43.52 54.05,49.52 50.69,52.87 50.29,52.87 U8.14 49.98,52.87 49.98,54.7 C30.1 | 49.98,68.62 49.98,70.04 C31.1 | U10.14 33.73,52.87 33.73,54.8 C33.1 33.73,55.11 33.73,58.36 35.25,59.88 35.25,67.3 | 35.25,67.3 34.44,68.11 34.03,68.11 U9.14 33.73,68.11 33.73,70.04 C32.1 33.62,70.34 27.73,76.24 20.21,76.24 C40.1 19.91,76.34 17.47,76.34 C39.1 17.16,76.24 14.02,76.24 SV24.7 13.71,76.24 11.48,76.24 SV24.8 | 49.98,68.62 45.31,68.62 45,68.92 36.88,68.92 35.25,67.3 | C48.1 20.42,31.74 17.77,31.74 C47.1 17.57,31.94 17.57,32.24 14.73,35.09 14.73,35.4 14.52,35.6 | 14.52,35.6 20.42,41.49 20.42,46.16 C49.1 | 14.52,35.6 14.02,35.6 SV21.7 13.71,35.6 11.48,35.6 SV21.8 | C38.1 19.91,61.71 17.47,61.71 C37.1 17.47,62.01 17.47,62.42 v16.66,63.23 | 38.09,18.23 C22.1 38.3,22.7 41.96,22.7 v42.26,23 | 38.09,18.23 38.7,17.62 U12.P$1 38.91,17.41 43.17,13.15 43.17,12.94 | 43.17,12.94 R33.2 | U12.P$2 37.48,17.62 38.09,18.23 | 43.17,12.94 52.01,12.94 J8.P$1 | L1.P$61 J152.P$1 J152.P$2 J152.P$3 121.71,80.91 121.71,80.2 93.87,52.36 93.87,51.65 89.91,47.69 75.48,47.69 IC2.24 75.18,47.59 74.37,48.4 74.37,50.43 C34.1 74.06,50.63 v72.74,51.96 | SV45.1 SV45.3 SV45.5 | SV2.4 330.19,88.12 327.86,88.12 SV2.3 SV2.1 J7.P$2 | SV2.4 SV2.2 | SV8.2 335.58,14.26 333.34,14.26 SV9.2 333.04,14.16 330.6,14.16 SV12.2 330.3,14.16 327.65,14.16 325.42,16.4 R21.2 325.12,16.5 325.12,21.78 R22.2 325.22,22.09 325.22,26.56 | 325.22,26.56 332.33,33.67 332.33,85.28 330.3,87.31 330.3,87.82 SV2.4
  Top 0.61: SV17.3 216.5,108.44 216.5,110.88 SV17.4 | J103.P$1 J103.P$2 J103.P$3 | SV25.4 188.56,110.88 188.56,108.44 SV25.3 188.87,108.34 192.02,105.19 | 192.02,105.19 197.4,105.19 200.55,108.34 201.26,108.34 SV26.3 | 192.02,105.19 v190.29,103.47 | 325.22,26.56 325.01,26.76 278.78,26.76 246.58,58.97 IC3.1
  Bottom 0.61: 15.23,63.23 14.22,63.23 14.02,63.44 SV23.7 13.71,63.44 11.68,63.44 SV23.8 11.37,63.44 10.15,62.22 10.15,52.77 11.37,51.55 11.37,50.84 SV28.8 11.27,50.53 10.15,49.42 10.15,37.53 11.37,36.31 11.37,35.6 SV21.8 | 15.23,63.23 v16.66,63.23 | 15.23,63.23 15.23,74.21 14.02,75.42 14.02,76.14 SV24.7 | 71.93,51.96 59.23,51.96 57.8,53.38 QG1.14 | 71.93,51.96 v72.74,51.96 | SV45.5 62.38,31.84 71.93,41.39 71.93,51.96 | v42.26,23 51.1,31.84 SV45.1 | IC3.13 228.8,51.45 229.61,51.45 233.37,55.21 247.09,55.21 247.8,55.92 247.8,57.75 246.58,58.97 IC3.1 246.27,59.17 245.56,59.17 231.75,72.99 228.19,72.99 226.87,74.31 226.87,83.15 227.48,83.76 227.48,97.37 219.55,105.3 216.4,105.3 214.57,107.12 | SV18.3 229.2,108.34 228.49,108.34 227.27,107.12 217.82,107.12 SV17.3 216.3,108.24 215.69,108.24 214.57,107.12 | J103.P$3 L1.P$21 185.62,88.94 185.62,89.14 190.29,93.81 v190.29,103.47 | 214.57,107.12 202.58,107.12 SV26.3 | L1.P$61 150.57,88.73 168.14,106.31 186.53,106.31 188.56,108.34 SV25.3
ADCA0
  Top 0.203: U11.21 229.51,86.4 228.59,86.4 220.77,94.22 220.77,97.17 218.44,99.5 SV16.7
ADCA2
  Top 0.203: U11.20 229.51,87.01 229.51,91.07 220.97,99.61 SV16.9
ADCA4
  Top 0.203: U11.19 237.84,87.01 237.84,98.08 241.4,101.64 241.4,103.47 241.09,103.77 220.06,103.77 218.44,102.15 SV16.8
ADCA6  (via drill 0.51)
  Top 0.203: v237.03,96.05 236.62,95.64 236.62,86.6 236.82,86.4 237.74,86.4 U11.18 | v216.81,106.31 214.98,106.31 210.81,102.15 SV16.2
  Bottom 0.203: v237.03,96.05 229.71,96.05 219.45,106.31 v216.81,106.31
ADCB2  (via drill 0.51)
  Top 0.203: v226.46,84.16 226.56,84.27 229.51,84.27 U11.24
  Bottom 0.203: v226.46,84.16 226.46,96.56 220.97,102.04 SV16.10
ADCB4  (via drill 0.51)
  Top 0.203: v225.34,84.16 226.16,83.35 226.77,83.35 227.07,83.65 229.51,83.65 U11.25
  Bottom 0.203: v225.34,84.16 225.34,85.89 221.99,89.24 221.99,96.35 219.55,98.79 219.55,100.01 218.64,100.93 217.01,100.93 215.89,102.04 SV16.6
ADCIN14
  Top 0.203: J105.P$1 J105.P$2 J105.P$3 L1.P$23
ADCIN15
  Top 0.203: J150.P$3 J150.P$2 J150.P$1 L1.P$63
ADCINA2
  Top 0.203: J111.P$1 J111.P$2 J111.P$3 L1.P$29
ADCINA3
  Top 0.203: J108.P$1 J108.P$2 J108.P$3 L1.P$26
ADCINA4
  Top 0.203: J144.P$3 J144.P$2 J144.P$1 L1.P$69
ADCINA5
  Top 0.203: J147.P$3 J147.P$2 J147.P$1 L1.P$66
ADCINB2
  Top 0.203: J110.P$1 J110.P$2 J110.P$3 L1.P$28
ADCINB3
  Top 0.203: J107.P$1 J107.P$2 J107.P$3 L1.P$25
ADCINB4
  Top 0.203: J145.P$3 J145.P$2 J145.P$1 L1.P$68
ADCINB5
  Top 0.203: J148.P$3 J148.P$2 J148.P$1 L1.P$65
ADCINC2  (via drill 0.51)
  Top 0.203: L1.P$27 J109.P$3 J109.P$2 J109.P$1 | v210.92,49.52 219.86,40.58 237.54,40.58 237.84,40.88 237.84,51.75 238.86,52.77 238.86,56.43 U15.P$4
  Bottom 0.203: v210.92,49.52 205.84,54.6 174.85,54.6 174.14,55.31 174.14,74.82 176.27,76.95 176.27,77.56 173.83,80 171.29,80 J109.P$1
ADCINC3  (via drill 0.51)
  Top 0.203: J106.P$1 J106.P$2 J106.P$3 L1.P$24 178.91,89.85 180.74,89.85 181.45,89.14 181.45,88.63 182.47,87.62 185.52,87.62 v189.38,83.76
  Bottom 0.203: v189.38,83.76 218.44,83.76 220.77,81.42 220.77,79.29 226.56,73.49 226.56,63.13 227.17,62.52 227.17,59.17 228.29,58.05 233.78,58.05 235.3,56.53 236.32,56.53 U15.P$5
ADCINC4  (via drill 0.51)
  Top 0.203: J146.P$3 J146.P$2 J146.P$1 L1.P$67 | v175.46,77.25 v188.26,64.45
  Bottom 0.203: v188.26,64.45 223.31,64.45 224.02,63.74 224.02,63.13 224.63,62.52 224.63,59.17 226.16,57.65 229.1,57.65 230.22,56.53 231.24,56.53 U15.P$7 | v175.46,77.25 132.38,77.25 122.02,87.62 116.43,87.62 115.41,88.63 115.41,89.14 114.4,90.16 113.89,90.16 112.87,91.17 112.87,91.68 112.16,92.39 108.81,92.39 107.79,91.38 107.79,90.46 106.67,89.34 L1.P$67
ADCINC5  (via drill 0.51)
  Top 0.203: L1.P$64 J149.P$1 J149.P$2 J149.P$3 | v211.73,44.13 198.01,44.13 v191.82,50.33
  Bottom 0.203: v211.73,44.13 222.6,55 226.26,55 227.68,56.43 228.7,56.43 U15.P$8 | v191.82,50.33 187.24,50.33 185.52,52.06 152.5,52.06 122.32,82.23 115.41,82.23 J149.P$3
ADXRS300_3V3
  Top 0.203: 241.7,37.94 241.7,38.85 R10.2 | 241.7,37.94 241.7,36.11 R9.1 | 241.7,37.94 J1.P$1 J1.P$2
DACOUTA
  Top 0.203: J112.P$1 J112.P$2 J112.P$3 L1.P$30
DACOUTB
  Top 0.203: J143.P$3 J143.P$2 J143.P$1 L1.P$70
EQEP1A
  Top 0.203: J3.P$1 J3.P$2
  Bottom 0.203: SV21.5 14.02,32.96 27.73,32.96 33.02,27.67 36.47,27.67 41.96,22.19 54.05,22.19 82.49,50.63 J3.P$1
EQEP1B
  Top 0.203: J6.P$1 J6.P$2
  Bottom 0.203: SV21.9 14.02,38.14 14.52,38.14 31.29,54.9 40.63,54.9 44.29,58.56 77.11,58.56 82.49,53.18 J6.P$1
EQEP2A
  Top 0.203: SV21.6 11.37,33.06 11.37,33.97 9.54,35.8 9.54,78.37 10.97,79.79 42.06,79.79 49.68,72.17 76.19,72.17 82.49,65.88 J2.P$1 J2.P$2
EQEP2B
  Top 0.203: J5.P$1 J5.P$2
  Bottom 0.203: SV21.10 11.48,38.14 12.49,38.14 29.66,55.31 40.43,55.31 52.01,66.89 80.97,66.89 82.49,68.41 J5.P$1
EQEP3A_5V  (via drill 0.51)
  Top 0.203: IC2.16 73.35,37.43 71.32,39.46 v68.57,39.46 | v19.4,41.9 14.22,47.08 12.59,47.08 11.48,48.2 SV28.6
  Bottom 0.203: v68.57,39.46 68.07,39.46 61.56,32.96 48.15,32.96 47.24,32.04 47.24,31.43 46.53,30.72 30.58,30.72 v19.4,41.9
EQEP3B_5V  (via drill 0.51)
  Top 0.203: IC2.14 75.79,34.89 76.6,34.07 76.6,33.16 76.4,32.96 56.08,32.96 54.86,34.18 54.86,34.79 46.73,42.91 27.32,42.91 22.04,48.2 v22.04,48.81
  Bottom 0.203: v22.04,48.81 17.47,48.81 14.12,52.16 12.59,52.16 11.48,53.28 SV28.10
GND  (via drill 0.51)
  Top 0.356: C28.2 300.22,107.52 U6.25 292.73,107.52 | U6.26 292.73,108.17 292.73,107.52 | 292.73,107.52 292.73,105.57 | 292.73,104.92 292.73,102.97 U6.18 | 292.73,105.57 U6.7 284.98,105.57 C26.2 | 292.73,105.57 292.73,104.92 | U6.21 292.73,104.92 | C13.2 220.34,84.98 220.34,85.02 U11.23 231.75,85.02 234.31,85.02 234.31,82.41 | U11.3 234.31,76.56 | 234.31,76.56 234.31,82.41 | U11.2 234.31,75.91 234.31,76.56 | U11.12 234.31,82.41
  Top 0.61: C37.2 17.47,58.87 19.91,58.87 C38.2 | U10.3 27.53,50.33 26.61,50.33 20.01,56.93 20.01,58.56 C38.2 | SV28.2 11.37,43.22 11.37,43.93 10.15,45.15 10.15,54.6 11.37,55.82 SV23.2 | SV24.2 11.37,68.52 11.37,67.8 10.15,66.59 10.15,57.04 11.17,56.02 SV23.2 | SV23.2 11.68,55.82 13.71,55.82 SV23.1 14.02,55.82 20.42,49.42 20.42,49.01 C49.2 20.52,48.7 21.94,47.28 21.94,36.21 20.52,34.79 C48.2 | C38.2 20.01,59.17 21.43,60.59 21.43,62.62 15.54,68.52 14.02,68.52 SV24.1 | v8.02,24.52 5.89,22.39 5.89,21.07 IC4.7 | C47.2 17.77,34.48 20.42,34.48 C48.2 | v14.83,18.02 16.15,16.7 16.45,16.7 C5.2 | 21.94,30.72 21.94,32.65 20.42,34.18 C48.2 | 21.94,30.72 19.91,28.69 14.73,28.69 14.02,27.98 SV21.1 | SV45.6 56.28,34.38 56.99,33.67 65.12,33.67 IC2.12 65.42,33.67 75.18,33.67 IC2.13 | C30.2 47.04,54.7 47.04,52.67 44.7,50.33 43.78,50.33 U8.3 43.58,50.13 42.67,50.13 v42.16,49.62 | SV45.4 SV45.2 SV75.6 SV75.4 SV75.2 43.48,34.38 38.2,29.1 38.2,25.64 C22.2 38.09,25.34 34.94,25.34 C23.2 34.64,25.44 29.56,30.52 22.14,30.52 21.94,30.72 | C10.2 38.7,93.51 35.86,93.51 34.84,94.53 34.84,98.89 C7.1 34.84,99.2 34.64,99.2 33.52,100.32 33.52,104.99 35.05,106.52 X1.G2 35.35,106.41 36.47,105.3 42.06,105.3 X1.5 | C18.2 69.59,105.3 69.59,107.53 SV6.5 72.44,107.73 75.58,107.73 77.82,105.5 77.82,105.3 C15.1 | C12.2 55.87,97.78 57.91,95.74 SV1.1 58.11,95.74 60.45,95.74 SV1.2 | v50.39,100.11 52.22,100.11 U2.15 | C39.2 17.47,73.49 19.91,73.49 C40.2 20.21,73.39 21.84,73.39 26.31,68.92 | 30.78,61.1 30.78,62.22 29.05,63.95 29.05,64.86 28.44,65.47 27.53,65.47 U9.3 27.32,65.67 26.51,65.67 26,66.18 26,68.62 26.31,68.92
  Top 0.61: 30.78,61.1 30.78,54.9 C33.2 | 26.31,68.92 27.43,70.04 30.78,70.04 C32.2 | SV4.2 76.09,79.79 76.09,82.23 SV4.1 75.99,82.54 75.99,88.02 75.69,88.33 U4.15 75.58,88.63 75.58,89.55 77.62,91.58 79.95,91.58 C14.2 80.16,91.88 83.81,95.54 SV3.5 | v69.59,48.6 71.42,50.43 C34.2 | IC2.1 65.22,47.59 v66.24,48.6 66.44,48.81 66.44,52.36 66.64,52.56 66.64,67.3 65.53,68.41 QG1.7 65.32,68.72 62.48,71.56 48.97,71.56 47.54,70.14 47.14,70.14 C31.2 | v47.75,67.5 45.82,65.57 43.78,65.57 U7.3 | v31.19,61.1 30.78,61.1 | U12.P$3 35.25,17.62 35.25,7.46 U12.P$6 35.45,7.25 38.5,7.25 42.97,2.78 LED6.C 43.17,2.58 43.38,2.58 47.24,6.44 J8.P$4 | J8.P$6 56.89,11.11 56.89,6.54 J8.P$5 56.69,7.05 52.32,7.05 J8.P$2 47.54,6.95 J8.P$4 | J8.P$3 47.34,11.11 47.34,6.74 J8.P$4 | SV68.1 65.32,7.56 65.32,5.32 SV68.2 65.32,5.02 65.32,2.58 SV68.3 65.63,2.58 70.1,2.58 SV69.3 | SV69.3 70.4,2.58 70.4,5.02 SV69.2 70.4,5.32 70.4,7.56 SV69.1 | SV70.3 75.48,2.58 75.48,5.02 SV70.2 75.48,5.32 75.48,7.56 SV70.1 | SV71.1 80.56,7.56 80.56,5.32 SV71.2 80.56,5.02 80.56,2.58 SV71.3 80.26,2.58 75.79,2.58 SV70.3 | SV69.3 70.71,2.58 75.18,2.58 SV70.3 | J151.P$3 J151.P$2 J151.P$1 L1.P$62 | J153.P$3 J153.P$2 J153.P$1 L1.P$60 | 148.43,22.8 156.56,30.93 162.35,30.93 C6.2 | 148.43,22.8 127.71,22.8 126.38,21.48 U$1.2 126.38,21.17 126.38,18.94 J124.P$1 126.38,18.63 126.38,16.6 J124.P$2 126.38,16.29 126.38,13.86 J124.P$3 126.08,13.75 120.49,8.17 98.44,8.17 B1.P$2 | SV2.5 327.65,85.58 330.19,85.58 SV2.6 330.3,85.28 330.3,84.77 331.52,83.55 331.52,76.75 330.4,75.63 SV2.14 | SV2.19 327.65,67.8 330.19,67.8 SV2.20
  Top 0.61: SV2.13 327.65,75.42 330.19,75.42 SV2.14 | SV2.20 330.4,68.01 330.4,68.72 331.52,69.84 331.52,73.9 330.3,75.12 SV2.14 | SV12.1 330.6,11.62 333.04,11.62 SV9.1 333.34,11.72 335.58,11.72 SV8.1 | SV2.29 327.65,55.11 330.19,55.11 SV2.30 | SV5.26 325.12,60.19 322.57,60.19 SV5.25 322.47,59.88 322.47,59.37 321.25,58.15 321.25,43.73 322.37,42.61 SV5.39 322.57,42.41 325.12,42.41 SV5.40 325.32,42.2 326.03,42.2 327.15,41.09 330.7,41.09 331.52,41.9 331.52,48.5 330.3,49.72 SV2.34 | SV2.33 327.65,50.02 330.19,50.02 SV2.34 | SV2.30 330.3,54.8 330.3,54.29 331.52,53.07 331.52,51.35 330.4,50.23 SV2.34 | SV2.20 330.3,67.5 330.3,66.99 331.52,65.77 331.52,56.43 330.4,55.31 SV2.30 | SV5.10 325.12,80.5 322.57,80.5 SV5.9 322.37,80.71 322.37,81.42 321.25,82.54 321.25,91.68 325.01,95.44 J7.P$1 325.12,95.74 326.33,96.96 326.33,101.84 C25.2 | C24.2 322.57,98.08 321.36,96.86 316.88,96.86 C27.2 316.58,96.76 314.65,96.76 314.04,96.15 311.5,96.15 311.09,96.56 311.09,100.72 316.17,105.8 X2.GND | 261,111.59 266.59,111.59 267.31,112.31 288.54,112.31 292.6,108.24 292.73,108.17 | 261,111.59 C11.2 | C28.2 300.32,107.12 302.76,107.12 C29.2 302.87,107.43 302.87,108.24 305.4,110.78 305.4,111.59 USB_PWR1.K | SV11.4 215.28,23.41 215.28,25.85 SV11.3 | U5.P$4 160.73,24.52 160.73,23.91 175.25,9.39 B3.P$1 | ETH1.P$12 195.27,7.46 191.51,3.7 180.94,3.7 175.46,9.18 B3.P$1 | J102.P$1 J102.P$2 J102.P$3 L1.P$20 185.62,45.76 185.82,45.76 v195.68,55.61 | v206.34,60.39 208.27,60.39 C4.2 208.48,60.59 208.48,102.76 v209.49,103.77 213.86,108.14 SV17.1 213.96,108.44 213.96,110.88 SV17.2 | v200.96,60.9 200.96,62.22 200.65,62.52 U3.4 200.55,62.83 200.55,63.44 J104.P$1 J104.P$2 J104.P$3
  Top 0.61: SV26.2 198.72,110.88 198.72,108.44 SV26.1 | SV25.1 186.02,108.44 186.02,110.88 SV25.2 | 256.43,104.58 256.43,105.7 256.53,105.8 SV15.4 | 256.43,104.58 256.43,103.36 R7.2 | SV15.12 246.38,105.9 248.92,105.9 SV15.10 249.12,105.9 251.45,105.9 SV15.8 251.66,105.7 252.78,104.58 256.43,104.58 | SV18.2 226.66,110.88 226.66,108.44 SV18.1 226.77,108.14 v226.77,104.58 | 231.75,85.02 231.75,100.11 P1.2 | 227.58,41.8 231.24,41.8 R14.1 231.54,41.8 236.42,41.8 R12.1 | 227.58,41.8 226.06,41.8 R16.1 | 227.58,41.8 227.58,49.82 226.26,51.14 IC3.12 226.16,51.45 226.16,53.89 U15.P$11 225.85,53.89 224.43,53.89 222.3,56.02 222.3,56.93 223.11,57.75 226.66,57.75 227.88,58.97 228.7,58.97 IC3.8 228.8,59.27 234.18,64.66 234.18,75.83 234.31,75.91 | C19.2 250.24,79.69 250.24,76.85 C20.2 250.54,76.85 251.05,76.85 252.47,75.42 252.47,67.09 245.16,59.78 245.16,57.54 244.24,56.63 U15.P$2 244.04,56.43 245.16,55.31 245.16,50.84 244.55,50.23 244.14,50.23 242.62,48.7 242.62,46.98 242.72,46.88 242.72,45.76 241.7,44.74 241.7,41.8 R10.1 | C21.2 247.09,79.39 250.03,79.39 C19.2 | SV16.1 210.81,94.02 219.86,84.98 220.34,84.98 | 261,111.59 261,90.16 250.54,79.69 C19.2 | 148.43,22.8 148.64,22.59 148.64,14.06 159,3.7 163.67,3.7 172.1,12.13 B3.P$1
  Bottom 0.61: SV24.2 11.48,68.62 13.91,68.62 SV24.1 | v8.02,24.52 11.37,27.88 SV21.2 11.68,27.88 13.71,27.88 SV21.1 14.02,27.88 14.02,20.16 14.83,19.34 14.83,19.24 | 14.83,19.24 v14.83,18.02 | v42.16,49.62 42.16,35.7 43.48,34.38 SV75.2 | SV45.4 SV45.6 56.48,34.48 62.17,34.48 71.11,43.42 71.11,47.08 v69.59,48.6 v66.24,48.6 | SV3.6 SV3.5 83.61,108.85 82.9,108.85 81.78,107.73 72.44,107.73 SV6.5 70.91,108.85 70.2,108.85 68.07,106.72 60.34,106.72 X1.G1 53.64,100.01 | 53.64,100.01 57.91,95.74 SV1.1 | 53.64,100.01 53.54,100.11 v50.39,100.11 50.18,100.32 47.95,100.32 43.07,105.19 42.16,105.19 X1.5 | SV4.2 75.99,79.69 75.99,79.39 65.53,68.92 QG1.7 65.32,68.62 64.21,67.5 v47.75,67.5 47.64,67.3 47.64,64.25 44.5,61.1 v31.19,61.1 | B1.P$2 98.34,8.07 96.01,8.07 94.48,6.54 81.58,6.54 80.56,7.56 SV71.1 | J8.P$5 56.89,6.54 64.21,6.54 65.22,7.56 SV68.1 | J153.P$3 121.91,25.85 126.28,21.48 U$1.2 | J151.P$3 119.38,60.08 123.24,56.22 123.24,46.88 L1.P$60 | 14.83,19.24 29.26,19.24 37.28,11.21 47.24,11.21 J8.P$3 | SV5.40 325.12,17.72 330.5,12.33 330.5,11.62 SV12.1 | USB_PWR1.K 305.4,111.59 311.09,105.9 316.17,105.9 X2.GND 316.48,105.7 317.5,104.69 317.5,103.36 325.12,95.74 J7.P$1 325.32,95.54 326.44,94.42 328.26,94.42 331.52,91.17 331.52,87.62 330.19,86.3 SV2.6 | ETH1.P$12 ETH1.P$1 222.3,7.66 222.3,10 ETH1.P$2 222.5,10.2 223.51,11.21 223.51,20.77 222.8,21.48 222.3,21.48 | 222.3,21.48 217.82,21.48 216,23.3 215.28,23.3 SV11.4 | v206.34,60.39 201.47,60.39 v200.96,60.9 v195.68,55.61 | J104.P$3 L1.P$22 | 209.49,99.61 207.56,99.61 SV26.1 | 209.49,99.61 210.81,99.61 SV16.1 | 209.49,99.61 v209.49,103.77
  Bottom 0.61: SV30.1 159.1,110.88 159.1,108.44 SV10.1 159.41,108.34 159.91,108.34 161.13,107.12 184.81,107.12 186.02,108.34 SV25.1 | SV26.2 198.72,110.98 198.01,110.98 196.69,112.31 187.45,112.31 186.13,110.98 SV25.2 | v226.77,104.58 230.12,101.23 230.12,101.13 231.03,100.22 231.75,100.22 P1.2 231.95,100.42 232.96,101.43 241.19,101.43 245.56,105.8 246.38,105.8 SV15.12 | IC3.8 228.8,59.07 229.61,59.07 230.73,60.19 239.47,60.19 240.18,59.47 240.18,58.56 240.99,57.75 242.72,57.75 243.94,56.53 U15.P$2 | 222.3,21.48 222.3,48.7 223.82,50.23 225.04,50.23 226.16,51.35 IC3.12
  pour Top: -0.01,-0.17 -0.01,114.13 339.08,114.13 339.08,-0.17
  pour Bottom: -0.01,-0.17 -0.01,114.13 339.08,114.13 339.08,-0.17
GPIO0
  Top 0.203: L1.P$40 J122.P$1 J122.P$2 J122.P$3
  Bottom 0.203: J122.P$3 185.41,62.73 188.16,65.47 188.16,83.65 196.19,91.68 196.19,108.34 SV25.9
GPIO1
  Top 0.203: L1.P$39 J121.P$1 J121.P$2 J121.P$3
  Bottom 0.203: J121.P$3 182.88,60.8 187.75,65.67 187.75,83.86 194.25,90.36 194.25,106.72 193.75,107.23 193.75,108.34 SV25.7
GPIO2  (via drill 0.51)
  Top 0.203: L1.P$38 J120.P$1 J120.P$2 J120.P$3 v180.33,63.03
  Bottom 0.203: v180.33,63.03 186.53,69.23 186.53,84.47 191.1,89.04 191.1,108.34 SV25.5
GPIO3  (via drill 0.51)
  Top 0.203: L1.P$37 J119.P$1 J119.P$2 J119.P$3 v177.79,59.37 | v193.03,106.21 194.76,107.94 194.76,108.55 196.19,109.97 196.19,110.88 SV25.10
  Bottom 0.203: v193.03,106.21 193.03,90.36 186.94,84.27 186.94,68.52 v177.79,59.37
GPIO4  (via drill 0.51)
  Top 0.203: L1.P$36 J118.P$1 J118.P$2 J118.P$3 | v192.53,107.53 192.53,108.85 193.64,109.97 193.64,110.88 SV25.8
  Bottom 0.203: v192.53,107.53 192.83,107.53 193.85,106.52 193.85,90.56 187.34,84.06 187.34,67.8 J118.P$3
GPIO5
  Top 0.203: L1.P$35 J117.P$1 J117.P$2 J117.P$3 172.72,76.24 176.37,79.9 176.37,88.84 177.39,89.85 177.9,89.85 178.91,90.87 178.91,99 187.14,107.23 187.14,111.09 188.16,112.1 188.97,112.1 190.09,110.98 191.1,110.98 SV25.6
GPIO6
  Top 0.203: J133.P$3 J133.P$2 J133.P$1 L1.P$80 120.8,46.98 114.19,46.98 113.18,45.96 113.18,37.83 111.35,36.01 88.39,36.01 85.74,38.65 75.28,38.65 IC2.17
GPIO7
  Top 0.203: L1.P$79 J134.P$1 J134.P$2 J134.P$3 120.49,56.83 122.32,56.83 123.03,56.12 123.03,47.69 122.32,46.98 121.81,46.98 120.8,45.96 120.8,37.83 117.75,34.79 85.34,34.79 84.02,36.11 75.28,36.11 IC2.15
GPIO8  (via drill 0.51)
  Top 0.203: L1.P$78 J135.P$1 J135.P$2 J135.P$3 153.51,92.39 v155.65,92.39 | v186.84,93.71 193.24,93.71 207.87,108.34 208.88,108.34 SV26.9
  Bottom 0.203: v186.84,93.71 185.52,92.39 v155.65,92.39
GPIO9
  Top 0.203: L1.P$77 J136.P$1 J136.P$2 J136.P$3 158.59,100.01 175.66,100.01 180.23,104.58 180.23,106.72 186.02,112.51 198.72,112.51 199.84,111.39 199.84,110.88 200.86,109.87 203.91,109.87 205.33,108.44 206.34,108.44 SV26.7
GPIO10  (via drill 0.51)
  Top 0.203: L1.P$76 J137.P$1 J137.P$2 J137.P$3 156.87,100.82 v164.08,100.82
  Bottom 0.203: v164.08,100.82 168.96,105.7 187.45,105.7 189.68,107.94 189.68,108.55 190.7,109.56 201.67,109.56 202.79,108.44 203.81,108.44 SV26.5
GPIO11
  Top 0.203: L1.P$75 J138.P$1 J138.P$2 J138.P$3
GPIO14
  Top 0.203: L1.P$74 J139.P$1 J139.P$2 J139.P$3
GPIO15
  Top 0.203: L1.P$73 J140.P$1 J140.P$2 J140.P$3
GPIO16  (via drill 0.51)
  Top 0.203: J115.P$3 J115.P$2 J115.P$1 L1.P$33 | v133.6,46.98 110.84,24.22 33.93,24.22 32.1,26.05 30.78,26.05 SV41.1
  Bottom 0.203: v133.6,46.98 166.52,46.98 L1.P$33
GPIO18  (via drill 0.51)
  Top 0.203: J16.P$3 J16.P$2 J16.P$1 L1.P$4 | v178.91,77.25 196.49,59.68 199.23,59.68 201.87,57.04 201.87,56.53 U3.6
  Bottom 0.203: v178.91,77.25 178.91,90.16 L1.P$4
GPIO19
  Top 0.203: J15.P$3 J15.P$2 J15.P$1 L1.P$3 181.45,90.16 186.02,90.16 204.41,71.77 204.41,62.62 U3.1
GPIO22
  Top 0.203: J20.P$3 J20.P$2 J20.P$1 L1.P$8 166.52,90.16 162.45,90.16 140.81,68.52 140.81,53.07 111.55,23.81 33.73,23.81 32.81,24.73 30.17,24.73 28.85,26.05 28.24,26.05 SV41.3
GPIO24
  Top 0.203: J9.P$2 210.2,33.57 210.2,36.01 J9.P$1 | L1.P$34 J116.P$1 J116.P$2 J116.P$3
  Bottom 0.203: J116.P$1 171.29,49.52 192.12,49.52 193.85,51.24 208.58,51.24 210.1,49.72 210.1,36.11 J9.P$1
GPIO25  (via drill 0.51)
  Top 0.203: L1.P$51 J162.P$1 J162.P$2 97.99,39.41 | v73.45,39.36 71.62,41.19 65.22,41.19 IC2.6 | v87.37,39.36 97.94,39.36 97.99,39.41 | J162.P$3 99.05,38.34 97.99,39.41
  Bottom 0.203: v87.37,39.36 v73.45,39.36
GPIO26  (via drill 0.51)
  Top 0.203: J160.P$3 J160.P$2 J160.P$1 L1.P$53 | v92.86,52.06 82.09,52.06 81.38,52.77 71.52,52.77 66.85,48.09 66.85,44.84 65.83,43.83 65.22,43.83 IC2.4
  Bottom 0.203: v92.86,52.06 96.11,52.06 98.95,49.21 102,49.21 103.02,48.2 103.02,46.67 L1.P$53
GPIO27
  Top 0.203: J11.P$2 210.2,18.33 210.2,20.77 J11.P$1 | J161.P$3 J161.P$2 J161.P$1 L1.P$52
  Bottom 0.203: J161.P$3 101.59,34.48 132.18,3.9 191.41,3.9 198.62,11.11 202.08,11.11 209.19,18.23 210.1,18.23 J11.P$2
GPIO29
  Top 0.203: L1.P$11 J29.P$3 J29.P$2 J29.P$1
  Bottom 0.203: J29.P$1 163.67,39.05 185.82,39.05 189.99,34.89 210.61,34.89 211.32,35.6 211.32,36.41 210.51,37.22 210.51,47.89 220.26,57.65 220.26,63.34 J37.P$2
GPIO32
  Top 0.203: L1.P$2 J14.P$1 J14.P$2 J14.P$3
GPIO40
  Top 0.203: L1.P$50 J163.P$1 J163.P$2 J163.P$3 100.07,98.89 101.7,100.52 148.03,100.52 155.24,107.73 R17.1 155.34,107.84 156.56,107.84 158.29,109.56 163.06,109.56 163.11,109.51 | SV10.3 163.11,109.51 | 163.11,109.51 164.18,110.58 164.18,110.88 SV30.3
GPIO41
  Top 0.203: R18.1 172.51,107.94 169.77,107.94 SV10.5 169.26,108.44 169.26,110.88 SV30.5 | L1.P$49 J164.P$1 J164.P$2 J164.P$3
  Bottom 0.203: J164.P$3 102.71,100.01 115.51,100.01 127.6,112.1 167.13,112.1 168.25,110.98 169.26,110.98 SV30.5
GPIO52
  Top 0.203: L1.P$48 J165.P$1 J165.P$2 J165.P$3
GPIO56
  Top 0.203: L1.P$44 J169.P$1 J169.P$2 J169.P$3
GPIO58
  Top 0.203: J33.P$1 J33.P$2 J33.P$3 L1.P$15 173.83,46.67 185.52,46.67 195.27,56.43 200.65,56.43 U3.5
GPIO59
  Top 0.203: J32.P$1 J32.P$2 J32.P$3 L1.P$14 171.29,46.67 172.82,46.67 173.83,47.69 173.83,76.75 175.15,78.07 179.22,78.07 197.2,60.08 201.26,60.08 203.19,62.01 U3.2
GPIO60
  Top 0.203: L1.P$7 J19.P$3 J19.P$2 J19.P$1
GPIO61
  Top 0.203: J101.P$1 J101.P$2 J101.P$3 L1.P$19
GPIO63  (via drill 0.51)
  Top 0.203: L1.P$55 J158.P$1 J158.P$2 J158.P$3 107.69,36.41 88.59,36.41 83.81,41.19 75.28,41.19 IC2.19 | J204.P$2 131.47,8.78 131.47,11.21 J204.P$1 | v211.32,38.75 208.78,36.21 208.78,33.06 208.07,32.35 v187.24,32.35
  Bottom 0.203: v211.32,38.75 210.92,39.15 210.92,47.69 222.8,59.58 222.8,63.34 J36.P$2 | v187.24,32.35 167.43,32.35 144.88,9.79 132.48,9.79 131.47,8.78 J204.P$2 | J158.P$3 109.21,37.63 125.27,21.58 125.27,18.43 126.28,17.41 126.89,17.41 127.81,16.5 127.81,15.89 128.82,14.87 129.43,14.87 130.35,13.96 130.35,12.33 131.36,11.32 J204.P$1
GPIO64  (via drill 0.51)